# Altium project 4WD_MotorController_DDR3.PrjPcb
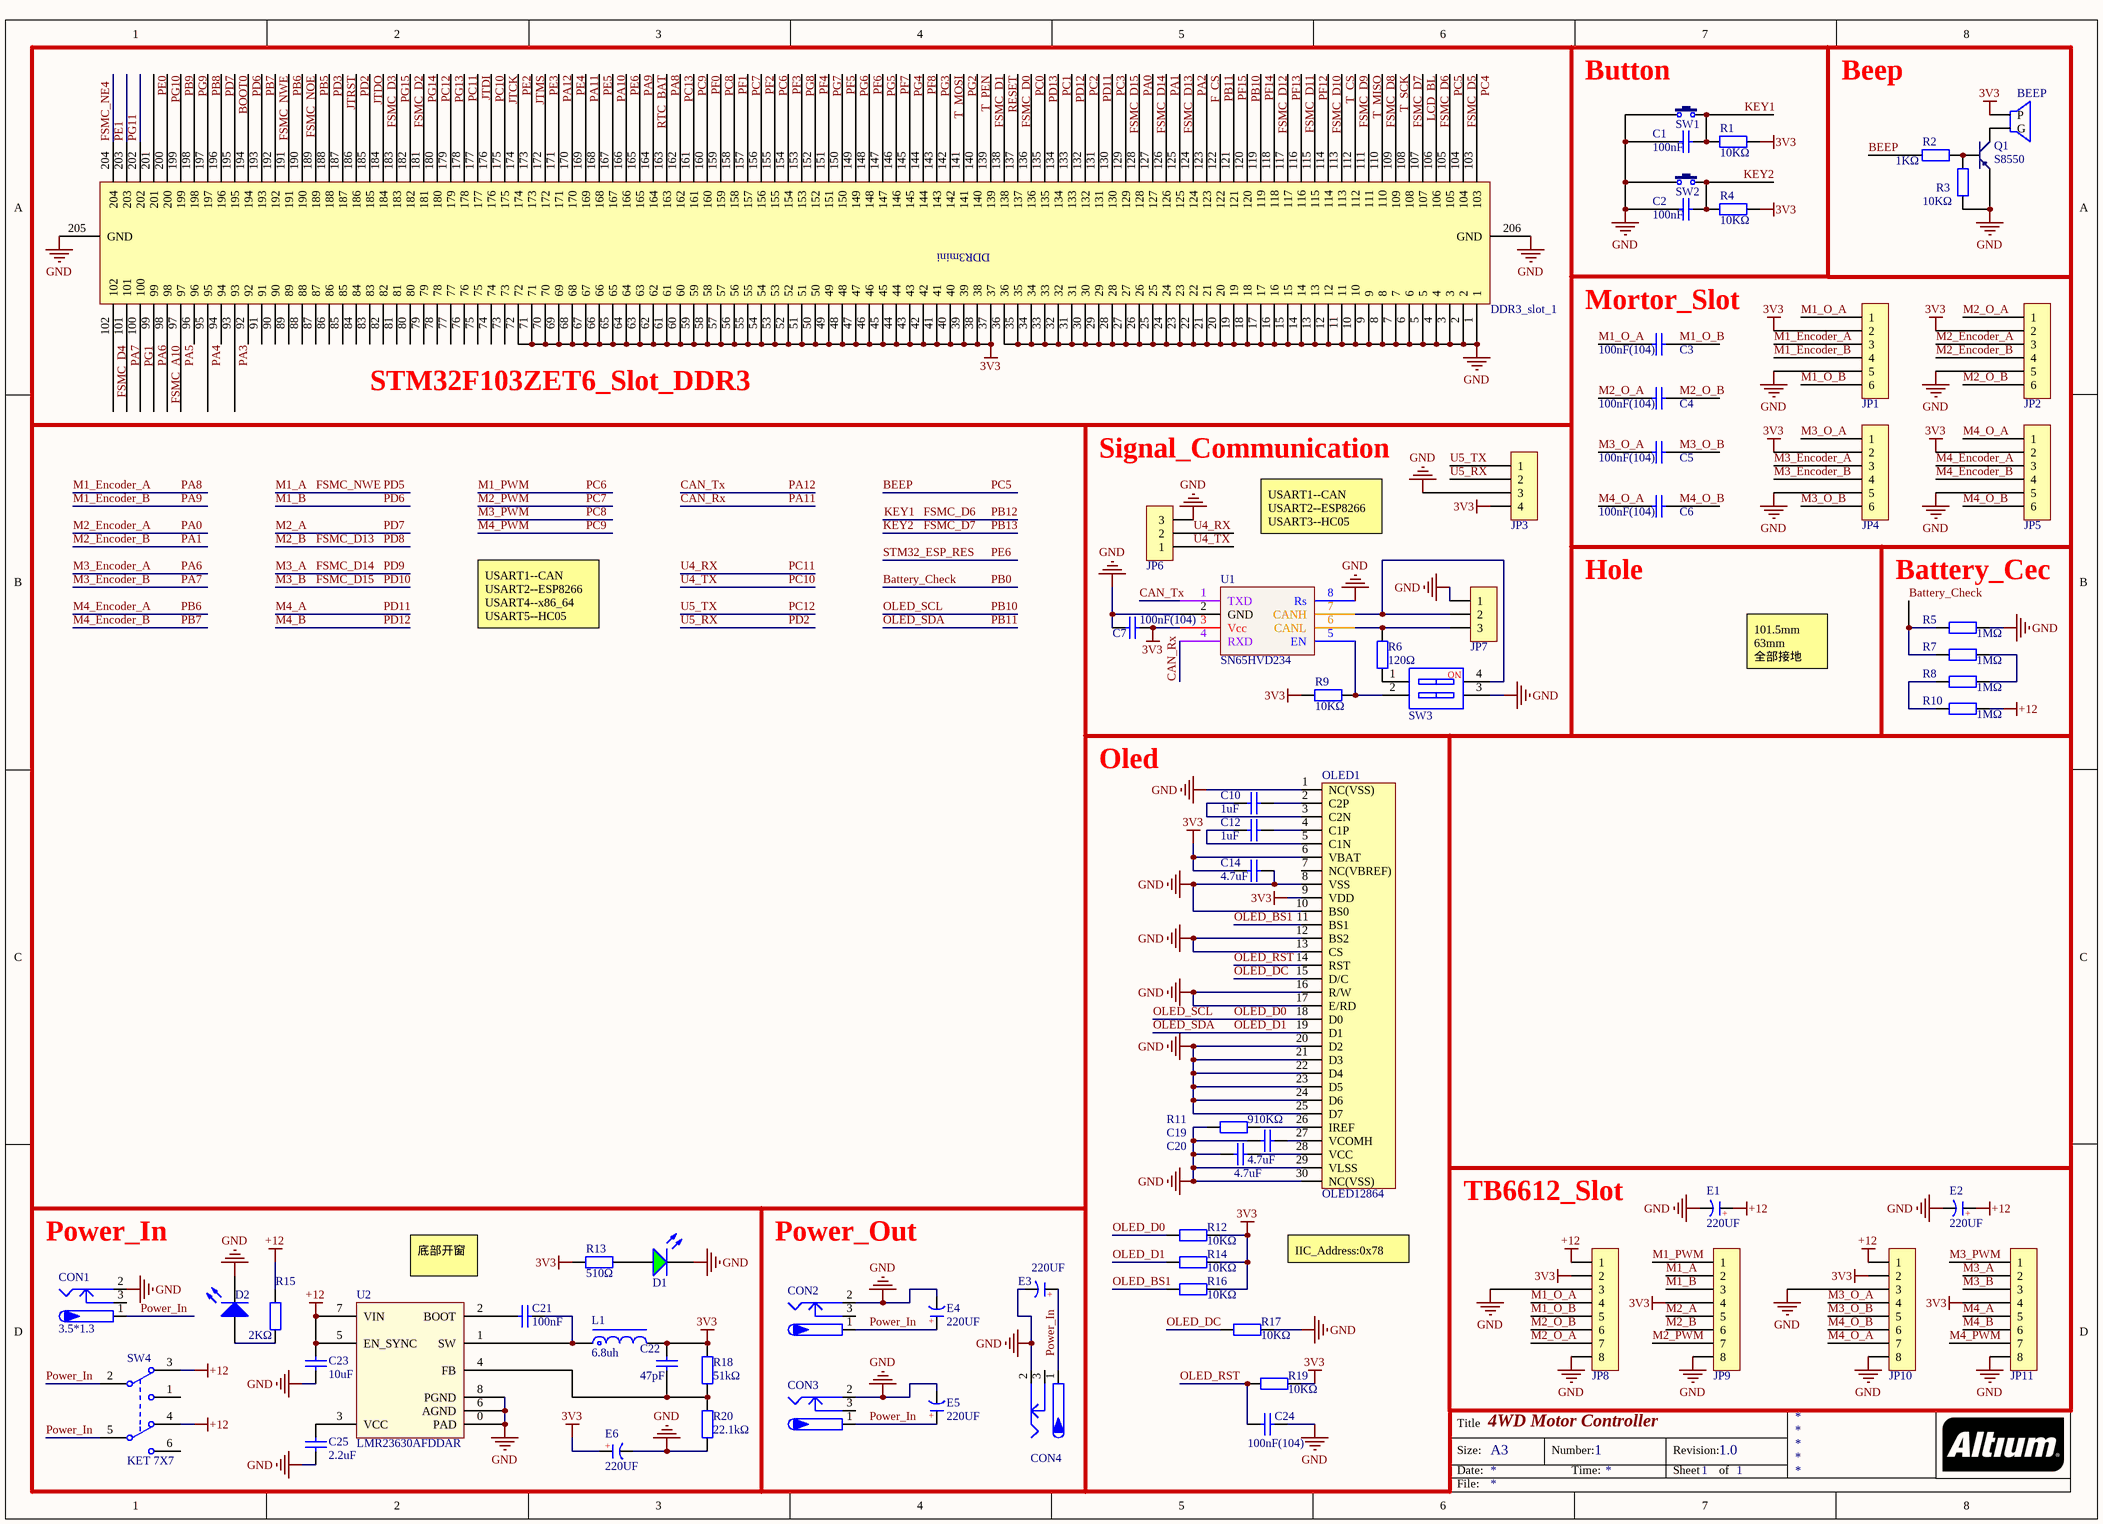
[diagram p0: 4WD_MotorController.SchDoc]
1 sheet, 71 parts. Net scope: global (net labels, ports and power ports of the same name join across sheets).
Board file: 4WD_MotorController.PcbDoc

## Sheet 4WD_MotorController.SchDoc: 4WD Motor Controller
size A3; DrawnBy: Erlnesa; Engineer: Erlnesa; DocumentNumber: 1; Revision: 1.0; SheetNumber: 1; SheetTotal: 1

### Parts
*1  DDR3_slot_1  [AS0A621]
BEEP?  BEEP  [BELL-5]
C1  100nF  [LC-0805_C]
C2  100nF  [LC-0805_C]
C3  100nF(104)  [LC-0805_C]
C4  100nF(104)  [LC-0805_C]
C5  100nF(104)  [LC-0805_C]
C6  100nF(104)  [LC-0805_C]
C7  100nF(104)  [LC-0805_C]
C10  1uF  [LC-0805_C]
C12  1uF  [LC-0805_C]
C14  4.7uF  [LC-0805_C]
C19  4.7uF  [LC-0805_C]
C20  4.7uF  [LC-0805_C]
C21  100nF  [LC-0805_C]
C22  47pF  [LC-0805_C]
C23  10uF  [LC-0805_C]
C24  100nF(104)  [LC-0805_C]
C25  2.2uF  [LC-0805_C]
CON1  3.5*1.3  [DC-005]
CON2  3.5*1.3  [DC-005]  (value not drawn)
CON3  3.5*1.3  [DC-005]  (value not drawn)
CON4  3.5*1.3  [DC-005]  (value not drawn)
D1  翠绿 0805  [LC-0805_LED_S1]  (value not drawn)
D2  蓝灯 0805  [LC-0805_LED_S1]  (value not drawn)
E1  220UF  [CAP 3.5*8*11.5 - BK]
E2  220UF  [CAP 3.5*8*11.5 - BK]
E3  220UF  [CAP 3.5*8*11.5 - BK]
E4  220UF  [CAP 3.5*8*11.5 - BK]
E5  220UF  [CAP 3.5*8*11.5 - BK]
E6  220UF  [CAP 3.5*8*11.5 - BK]
JP1  HDR-1X6  [PH2.0 D-W-6P]  (value not drawn)
JP2  HDR-1X6  [PH2.0 D-W-6P]  (value not drawn)
JP3  HDR-1X4  [XH2.54-4P_H]  (value not drawn)
JP4  HDR-1X6  [PH2.0 D-W-6P]  (value not drawn)
JP5  HDR-1X6  [PH2.0 D-W-6P]  (value not drawn)
JP6  HDR-1X3  [XH2.54-3P_H]  (value not drawn)
JP7  HDR-1X3  [XH2.54-3P_H]  (value not drawn)
JP8  HDR-1X8  [HDR-1X8_M]  (value not drawn)
JP9  HDR-1X8  [HDR-1X8_M]  (value not drawn)
JP10  HDR-1X8  [HDR-1X8_M]  (value not drawn)
JP11  HDR-1X8  [HDR-1X8_M]  (value not drawn)
L1  6.8uh  [L-SMD-0630]
OLED1  OLED12864  [OLED]
Q1  S8550  [SOT23-3L]
R1  10KΩ  [LC-0805_R]
R2  1KΩ  [LC-0805_R]
R3  10KΩ  [LC-0805_R]
R4  10KΩ  [LC-0805_R]
R5  1MΩ  [LC-0805_R]
R6  120Ω  [LC-0805_R]
R7  1MΩ  [LC-0805_R]
R8  1MΩ  [LC-0805_R]
R9  10KΩ  [LC-0805_R]
R10  1MΩ  [LC-0805_R]
R11  910KΩ  [LC-0805_R]
R12  10KΩ  [LC-0805_R]
R13  510Ω  [LC-0805_R]
R14  10KΩ  [LC-0805_R]
R15  2KΩ  [LC-0805_R]
R16  10KΩ  [LC-0805_R]
R17  10KΩ  [LC-0805_R]
R18  51kΩ  [LC-0805_R]
R19  10KΩ  [LC-0805_R]
R20  22.1kΩ  [LC-0805_R]
SW1  3x6x5  [TSW SMD-3*6*2.5]  (value not drawn)
SW2  3x6x5  [TSW SMD-3*6*2.5]  (value not drawn)
SW3  CSW-2P  [CSW1.27 SMD-2P]  (value not drawn)
SW4  KET 7X7  [KFT DIP-7X7]
U1  SN65HVD234  [SOP8W_M]
U2  LMR23630AFDDAR  [LC-SOP-8_EP_150mil]

### Nets
3V3: *1.37 *1.38 *1.39 *1.40 *1.41 *1.42 *1.43 *1.44 *1.45 *1.46 *1.47 *1.48 *1.49 *1.50 *1.51 *1.52 *1.53 *1.54 *1.55 *1.56 *1.57 *1.58 *1.59 *1.60 *1.61 *1.62 *1.63 *1.64 *1.65 *1.66 *1.67 *1.68 *1.69 *1.70 *1.71 *1.72 BEEP?.1(P) C7.2 C14.1 C22.2 E6.1(A) JP1.2 JP2.2 JP3.4 JP4.2 JP5.2 JP8.2 JP9.4 JP10.2 JP11.4 L1.2 OLED1.6(VBAT) OLED1.9(VDD) R1.2 R4.2 R9.2 R12.2 R13.2 R14.2 R16.2 R18.2 R19.2 U1.3(Vcc)
+12: C23.1 E1.1(A) E2.1(A) JP8.1 JP10.1 R10.1 R15.2 SW4.3(NO1) SW4.4(NO2) U2.5(EN_SYNC) U2.7(VIN)
GND: *1.1 *1.2 *1.3 *1.4 *1.5 *1.6 *1.7 *1.8 *1.9 *1.10 *1.11 *1.12 *1.13 *1.14 *1.15 *1.16 *1.17 *1.18 *1.19 *1.20 *1.21 *1.22 *1.23 *1.24 *1.25 *1.26 *1.27 *1.28 *1.29 *1.30 *1.31 *1.32 *1.33 *1.34 *1.35 *1.36 *1.205(GND) *1.206(GND) C1.1 C2.1 C7.1 C14.2 C19.1 C20.1 C23.2 C24.2 C25.1 CON1.2 CON2.2 CON3.2 CON4.2 D1.K D2.K E1.2(K) E2.2(K) E3.2(K) E4.2(K) E5.2(K) E6.2(K) JP1.5 JP2.5 JP3.3 JP4.5 JP5.5 JP6.3 JP7.1 JP8.3 JP8.8 JP9.8 JP10.3 JP10.8 JP11.8 OLED1.1(NC(VSS)) OLED1.8(VSS) OLED1.10(BS0) OLED1.12(BS2) OLED1.13(CS) OLED1.16(R/W) OLED1.17(E/RD) OLED1.20(D2) OLED1.21(D3) OLED1.22(D4) OLED1.23(D5) OLED1.24(D6) OLED1.25(D7) OLED1.29(VLSS) OLED1.30(NC(VSS)) Q1.1(E) R3.1 R5.2 R11.1 R17.2 R20.2 SW1.1 SW2.1 SW3.3 U1.2(GND) U1.8(Rs) U2.0(PAD) U2.6(AGND) U2.8(PGND)
Battery_Check: R5.1 R7.2  [also labelled PB0]
BEEP: *1.105 R2.1  [also labelled PC5]
BOOT0: *1.195
CAN_Rx: *1.169 U1.4(RXD)  [also labelled PA11]
CAN_Tx: *1.171 U1.1(TXD)  [also labelled PA12]
F_CS: *1.123
FSMC_A10: *1.98
FSMC_D0: *1.137
FSMC_D1: *1.139
FSMC_D2: *1.182
FSMC_D3: *1.184
FSMC_D4: *1.102
FSMC_D5: *1.104
FSMC_D6: *1.106 C1.2 R1.1 SW1.2  [also labelled KEY1, PB12]
FSMC_D7: *1.108 C2.2 R4.1 SW2.2  [also labelled KEY2, PB13]
FSMC_D8: *1.110
FSMC_D9: *1.112
FSMC_D10: *1.114
FSMC_D11: *1.116
FSMC_D12: *1.118
FSMC_D13: *1.125 JP9.6  [also labelled M2_B, PD8]
FSMC_D14: *1.127 JP11.2  [also labelled M3_A, PD9]
FSMC_D15: *1.129 JP11.3  [also labelled M3_B, PD10]
FSMC_NE4: *1.204
FSMC_NOE: *1.190
FSMC_NWE: *1.192 JP9.2  [also labelled M1_A, PD5]
JTCK: *1.175
JTDI: *1.177
JTDO: *1.185
JTMS: *1.173
JTRST: *1.187
LCD_BL: *1.107
M1_B: *1.194 JP9.3  [also labelled PD6]
M1_Encoder_A: *1.163 JP1.3  [also labelled PA8]
M1_Encoder_B: *1.165 JP1.4  [also labelled PA9]
M1_O_A: C3.1 JP1.1 JP8.4
M1_O_B: C3.2 JP1.6 JP8.5
M1_PWM: *1.155 JP9.1  [also labelled PC6]
M2_A: *1.196 JP9.5  [also labelled PD7]
M2_Encoder_A: *1.128 JP2.3  [also labelled PA0]
M2_Encoder_B: *1.126 JP2.4  [also labelled PA1]
M2_O_A: C4.1 JP2.1 JP8.7
M2_O_B: C4.2 JP2.6 JP8.6
M2_PWM: *1.157 JP9.7  [also labelled PC7]
M3_Encoder_A: *1.99 JP4.3  [also labelled PA6]
M3_Encoder_B: *1.101 JP4.4  [also labelled PA7]
M3_O_A: C5.1 JP4.1 JP10.4
M3_O_B: C5.2 JP4.6 JP10.5
M3_PWM: *1.159 JP11.1  [also labelled PC8]
M4_A: *1.131 JP11.5  [also labelled PD11]
M4_B: *1.133 JP11.6  [also labelled PD12]
M4_Encoder_A: *1.191 JP5.3  [also labelled PB6]
M4_Encoder_B: *1.193 JP5.4  [also labelled PB7]
M4_O_A: C6.1 JP5.1 JP10.7
M4_O_B: C6.2 JP5.6 JP10.6
M4_PWM: *1.161 JP11.7  [also labelled PC9]
OLED_BS1: OLED1.11(BS1) R16.1
OLED_D0: *1.120 OLED1.18(D0) R12.1  [also labelled OLED_SCL, PB10]
OLED_D1: *1.122 OLED1.19(D1) R14.1  [also labelled OLED_SDA, PB11]
OLED_DC: OLED1.15(D/C) R17.1
OLED_RST: C24.1 OLED1.14(RST) R19.1
PA2: *1.124
PA3: *1.93
PA4: *1.95
PA5: *1.97
PA10: *1.167
PB5: *1.189
PB8: *1.197
PB9: *1.199
PC0: *1.136
PC1: *1.134
PC2: *1.132
PC3: *1.130
PC4: *1.103
PC10: *1.176 JP6.1  [also labelled U4_TX]
PC11: *1.178 JP6.2  [also labelled U4_RX]
PC12: *1.180 JP3.1  [also labelled U5_TX]
PC13: *1.162
PD2: *1.186 JP3.2  [also labelled U5_RX]
PD3: *1.188
PD13: *1.135
PE0: *1.201
PE1: *1.203
PE2: *1.174
PE3: *1.172
PE4: *1.170
PE5: *1.168
PE6: *1.166  [also labelled STM32_ESP_RES]
PF0: *1.160
PF1: *1.158
PF2: *1.156
PF3: *1.154
PF4: *1.152
PF5: *1.150
PF6: *1.148
PF7: *1.146
PF8: *1.144
PF12: *1.115
PF13: *1.117
PF14: *1.119
PF15: *1.121
PG1: *1.100
PG2: *1.141
PG3: *1.143
PG4: *1.145
PG5: *1.147
PG6: *1.149
PG7: *1.151
PG8: *1.153
PG9: *1.198
PG10: *1.200
PG11: *1.202
PG13: *1.179
PG14: *1.181
PG15: *1.183
Power_In: CON1.1 CON2.1 CON3.1 CON4.1 E3.1(A) E4.1(A) E5.1(A) SW4.2(COM2) SW4.5(COM2)
RESET: *1.138
RTC_BAT: *1.164
T_CS: *1.113
T_MISO: *1.111
T_MOSI: *1.142
T_PEN: *1.140
T_SCK: *1.109
NetBEEP?_2: BEEP?.2(G) Q1.3(C)
NetC10_1: C10.1 OLED1.3(C2N)
NetC10_2: C10.2 OLED1.2(C2P)
NetC12_1: C12.1 OLED1.5(C1N)
NetC12_2: C12.2 OLED1.4(C1P)
NetC19_2: C19.2 OLED1.27(VCOMH)
NetC20_2: C20.2 OLED1.28(VCC)
NetC21_1: C21.1 L1.1 U2.1(SW)
NetC21_2: C21.2 U2.2(BOOT)
NetC22_1: C22.1 R18.1 R20.1 U2.4(FB)
NetC25_2: C25.2 U2.3(VCC)
NetD1_A: D1.A R13.1
NetD2_A: D2.A R15.1
NetJP7_2: JP7.2 SW3.4 U1.7(CANH)
NetJP7_3: JP7.3 R6.2 U1.6(CANL)
NetOLED1_26: OLED1.26(IREF) R11.2
NetQ1_2: Q1.2(B) R2.2 R3.2
NetR6_1: R6.1 SW3.1
NetR7_1: R7.1 R8.2
NetR8_1: R8.1 R10.2
NetR9_1: R9.1 SW3.2 U1.5(EN)

Not connected (* = marked no-connect by the designer): *1 73 74 75 76 77 78 79 80 81 82 83 84 85 86 87 88 89 90 91 92 94 96; CON1 3; CON2 3; CON3 3; CON4 3; OLED1 7(NC(VBREF)); SW4 1(NC1) 6(NC2)

### Notes on the sheet
- (near SW1) Button
- Beep
- (near C3) Mortor_Slot
- STM32F103ZET6_Slot_DDR3
- Signal_Communication
- USART1--CAN
  USART2--ESP8266
  USART3--HC05
- (near C6) Hole
- Battery_Cec
- USART1--CAN
  USART2--ESP8266
  USART4--x86_64
  USART5--HC05
- 101.5mm
  63mm
  全部接地
- Oled
- TB6612_Slot
- (near CON1) Power_In
- 底部开窗
- Power_Out
- IIC_Address:0x78
- Title
- Size:
- Date:
- A3
- Number:
- Time:
- Revision:
- Sheet
- of
- File:
- (in symbol C-CAP) +
- (in symbol CSW-2P) NO
- (in symbol DDR3_slot_1) DDR3mini

### Library data of the parts
C1-C7 C21 C24 = 0805 100nF(104) 10% 50V: 贴片电容; ComponentLink1Description: 供应商链接; ComponentLink1URL: http://www.szlcsc.com/product/details_50686.html; Package: 0805; Supplier: LC; SuppliersPartNumber: C49678
C10 C12 = 0805 1uF (105) 10% 50V: 贴片电容; ComponentLink1Description: 供应商链接; ComponentLink1URL: http://www.szlcsc.com/product/details_29074.html; Package: 0805; Supplier: LC; SuppliersPartNumber: C28323
C14 C19 C20 = 0805 4.7uF (475) 10% 25V: 贴片电容; ComponentLink1Description: 供应商链接; ComponentLink1URL: http://www.szlcsc.com/product/details_2131.html; Package: 0805; Supplier: LC; SuppliersPartNumber: C1779
C22 = 0805 47pF (470) 5% 50V: 贴片电容; ComponentLink1Description: 供应商链接; ComponentLink1URL: http://www.szlcsc.com/product/details_15529.html; Package: 0805; Supplier: LC; SuppliersPartNumber: C14857
C23 = 0805 10uF (106) 10% 25V: 贴片电容; ComponentLink1Description: 供应商链接; ComponentLink1URL: http://www.szlcsc.com/product/details_16532.html; Package: 0805; Supplier: LC; SuppliersPartNumber: C15850
C25 = 0805 2.2uF (225) 20% 50V: 贴片电容; ComponentLink1Description: 供应商链接; ComponentLink1URL: http://www.szlcsc.com/product/details_50225.html; Package: 0805; Supplier: LC; SuppliersPartNumber: C49217
CON1-CON4 = P-DC: 低压电源接口; BOM名称: DC电源接口; 版权归属: 源创客; 学习资源: www.ooocke.com
D1 = 0805 翠绿: 发光二极管; ComponentLink1Description: 供应商链接; ComponentLink1URL: http://www.szlcsc.com/product/details_2670.html; Package: 0805; Supplier: LC; SuppliersPartNumber: C2297
D2 = 0805 蓝灯: 发光二极管; ComponentLink1Description: 供应商链接; ComponentLink1URL: http://www.szlcsc.com/product/details_2666.html; Package: 0805; Supplier: LC; SuppliersPartNumber: C2293
E1-E6 = C-CAP: 直插电解电容; 版权归属: 黎明电子style; BOM名称: 直插电解电容; 学习资源: https://lmdzstyle.taobao.com/
JP1 JP2 JP4 JP5 = Header 6: 6P接插件; 版权归属: 黎明电子style; BOM名称: 6P接插件; 学习资源: https://lmdzstyle.taobao.com/
JP3 = Header 4: 4P接插件; 版权归属: 黎明电子style; BOM名称: 4P接插件; 学习资源: https://lmdzstyle.taobao.com/
JP6 = Header 3: 3P接插件; 版权归属: 黎明电子style; BOM名称: 3P接插件; 学习资源: https://lmdzstyle.taobao.com/
JP7 = Header 3: 3P接插件; 版权归属: 源创客; BOM名称: 3P接插件; 学习资源: www.ooocke.com
JP8-JP11 = Header 8: 8P接插件; 版权归属: 黎明电子style; BOM名称: 8P接插件; 学习资源: https://lmdzstyle.taobao.com/
L1 = L-CDRH: 功率屏蔽电感; 版权归属: 黎明电子style; BOM名称: 功率屏蔽电感; 学习资源: https://lmdzstyle.taobao.com/
Q1 = PNP: 8550/BCW68
R1 R3 R4 R9 R12 R14 R16 R17 R19 = 0805 10KΩ (1002) 1%: 贴片电阻; ComponentLink1Description: 供应商链接; ComponentLink1URL: http://www.szlcsc.com/product/details_18102.html; Package: 0805; Supplier: LC; SuppliersPartNumber: C17414
R2 = 0805 1KΩ (1001) 1%: 贴片电阻; ComponentLink1Description: 供应商链接; ComponentLink1URL: http://www.szlcsc.com/product/details_18201.html; Package: 0805; Supplier: LC; SuppliersPartNumber: C17513
R5 R7 R8 R10 = 0805 1MΩ (1004) 1%: 贴片电阻; ComponentLink1Description: 供应商链接; ComponentLink1URL: http://www.szlcsc.com/product/details_18202.html; Package: 0805; Supplier: LC; SuppliersPartNumber: C17514
R6 = 0805 120Ω (1200) 1%: 贴片电阻; ComponentLink1Description: 供应商链接; ComponentLink1URL: http://www.szlcsc.com/product/details_18125.html; Package: 0805; Supplier: LC; SuppliersPartNumber: C17437
R11 = 0805 91KΩ (9102) 1%: 贴片电阻; ComponentLink1Description: 供应商链接; ComponentLink1URL: http://www.szlcsc.com/product/details_18554.html; Package: 0805; Supplier: LC; SuppliersPartNumber: C17866
R13 = 0805 510Ω (5100) 1%: 贴片电阻; ComponentLink1Description: 供应商链接; ComponentLink1URL: http://www.szlcsc.com/product/details_18422.html; Package: 0805; Supplier: LC; SuppliersPartNumber: C17734
R15 = 0805 2KΩ (2001) 1%: 贴片电阻; ComponentLink1Description: 供应商链接; ComponentLink1URL: http://www.szlcsc.com/product/details_18292.html; Package: 0805; Supplier: LC; SuppliersPartNumber: C17604
R18 R20 = 0805 1Ω (1R00) 1%: 贴片电阻; ComponentLink1Description: 供应商链接; ComponentLink1URL: http://www.szlcsc.com/product/details_26014.html; Package: 0805; Supplier: LC; SuppliersPartNumber: C25271
SW1 SW2 = TSW 3x6: 3x6轻触开关; 版权归属: 黎明电子style; BOM名称: 3x6轻触开关; 学习资源: https://lmdzstyle.taobao.com/
SW3 = CSW-2P: 2路编码开关; 版权归属: 源创客; BOM名称: 2路编码开关; 学习资源: www.ooocke.com
SW4 = KET 7X7: 7*7自锁开关; 版权归属: 源创客; BOM名称: 7*7自锁开关; 学习资源: www.ooocke.com
U1 = SN65HVD234: CAN收发器，3.3V供电
U2 = LMR23630AFDDAR: 4-36V_INPUT;3A_OUTPUT